# EasyEDA schematic SCH_pcie_2022-12-23.json
TITLE: Sheet_1; REV: 1.0; Date: 2022-12-23; Sheet: 1/1; Company: Your Company
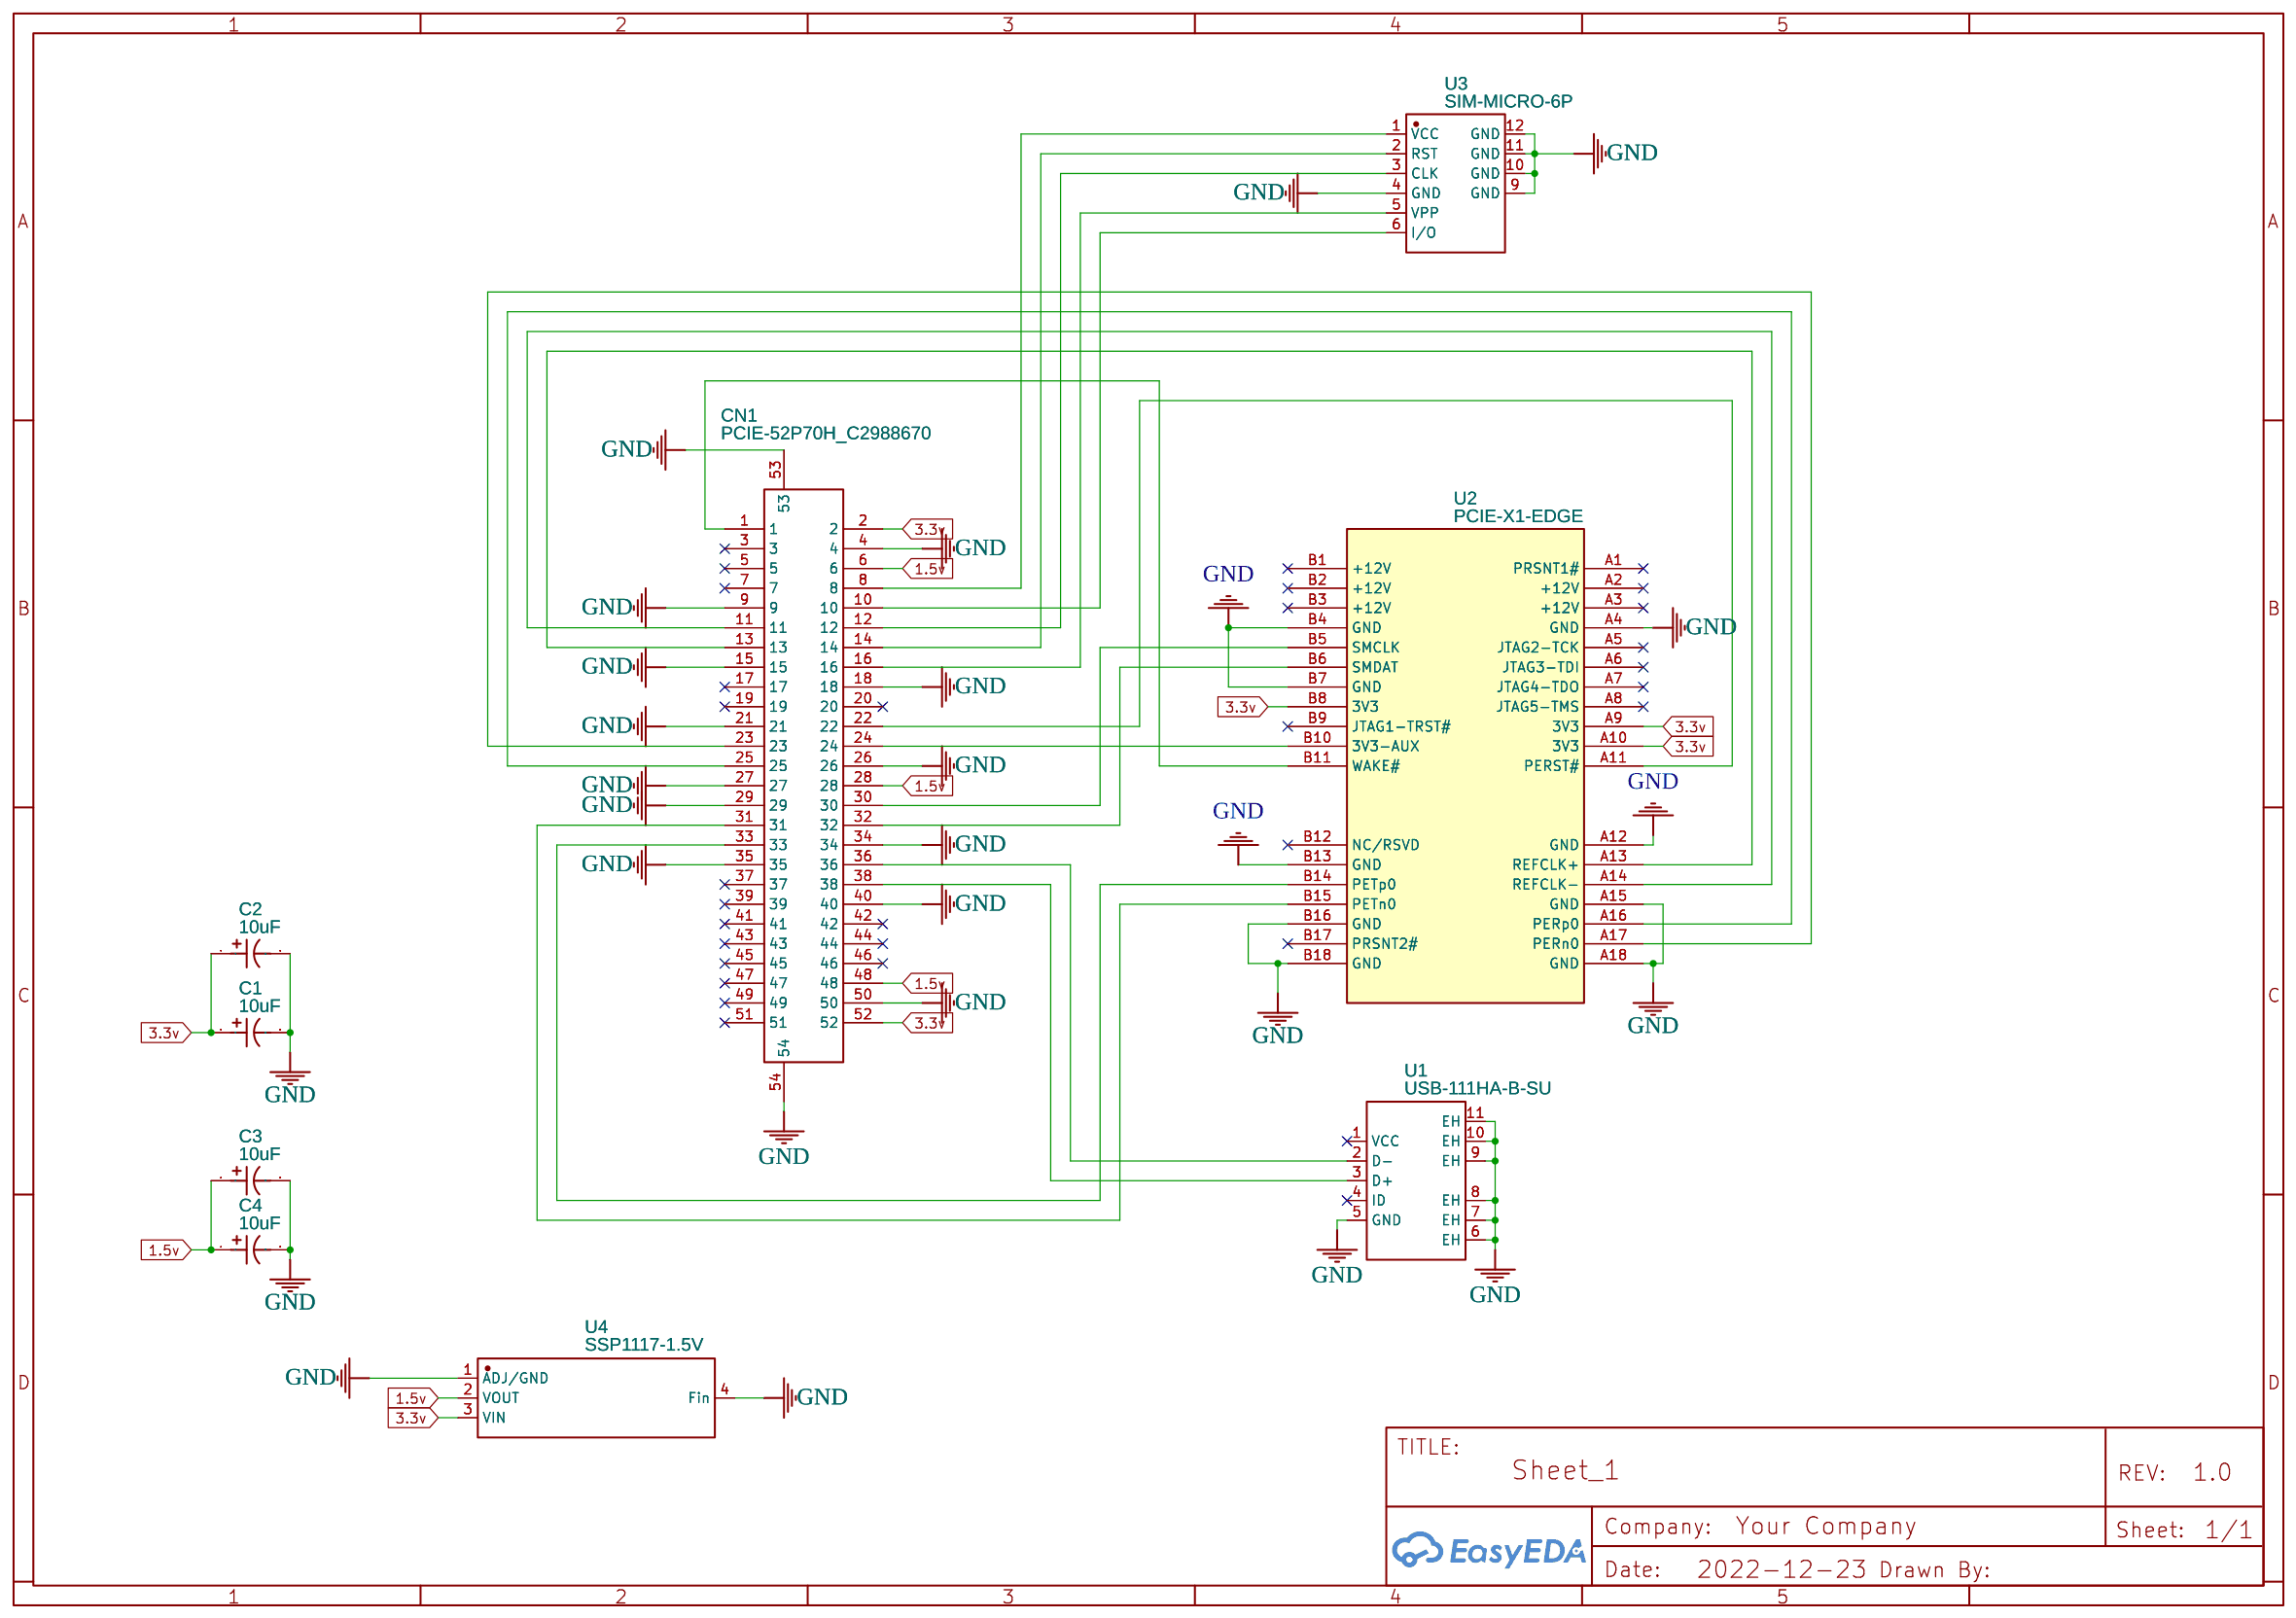
[diagram p0: schematic sheet]

## Parts
C1  10uF  [CAP-SMD_BD4.0-L4.3-W4.3-FD-LS4.8]
C2  10uF  [CAP-SMD_BD4.0-L4.3-W4.3-FD-LS4.8]
C3  10uF  [CAP-SMD_BD4.0-L4.3-W4.3-FD-LS4.8]
C4  10uF  [CAP-SMD_BD4.0-L4.3-W4.3-FD-LS4.8]
CN1  PCIE-52P70H_C2988670  [PCIE-SMD_52P-P0.80_PCIE-52PXXH]
U1  USB-111HA-B-SU  [MICRO-USB-SMD_USB-111HA-B-SU]
U2  PCIE-X1-EDGE  [PCIE-X1-MALE]
U3  SIM-MICRO-6P  [MICRO-SIM-SMD_KH-SIM1616-6PIN]
U4  SSP1117-1.5V  [SOT-223_L6.3-W3.5-P2.30-LS7.0-BR]

## Library data of the parts
C1-C4 = XT10UF35V90RV0070: Supplier: LCSC; Supplier Part: C2992602; Manufacturer: KNSCHA(科尼盛); Contributor: lcsc; JLCPCB Part Class: Extended Part
CN1 = PCIE-52P70H_C2988670: Supplier: LCSC; Supplier Part: C2988670; Manufacturer: SOFNG(硕方); Manufacturer Part: PCIE-52P70H; link: https://atta.szlcsc.comnull; Contributor: LCSC; JLCPCB Part Class: Extended Part
U1 = USB-111HA-B-SU: Supplier: LCSC; Supplier Part: C2939565; Manufacturer: HOOYA(皓宇电子); link: https://atta.szlcsc.com/upload/public/pdf/source/20220124/242EE7715A4A3C37825CBDA142240E59.pdf; JLCPCB Part Class: Extended Part; Contributor: lcsc
U2 = PCIE-X1-EDGE: Contributor: dcs515
U3 = SIM-MICRO-6P: Supplier: LCSC; Supplier Part: C9900009166; Manufacturer: null; Contributor: LCSC; JLCPCB Part Class: Extended Part
U4 = SSP1117-1.5V: Supplier: LCSC; Supplier Part: C308941; Manufacturer: Shanghai Siproin Microelectronics; Contributor: LCSC; JLCPCB Part Class: Extended Part

## Nets
1.5v: C3.1 C4.1 CN1.6 CN1.28 CN1.48 U4.2(VOUT)
3.3v: C1.1 C2.1 CN1.2 CN1.52 U2.A9(3V3) U2.A10(3V3) U2.B8(3V3) U4.3(VIN)
GND: C1.2 C2.2 C3.2 C4.2 CN1.4 CN1.9 CN1.15 CN1.18 CN1.21 CN1.26 CN1.27 CN1.29 CN1.34 CN1.35 CN1.40 CN1.50 CN1.53 CN1.54 U1.5(GND) U1.6(EH) U1.7(EH) U1.8(EH) U1.9(EH) U1.10(EH) U1.11(EH) U2.A4(GND) U2.A12(GND) U2.A15(GND) U2.A18(GND) U2.B4(GND) U2.B7(GND) U2.B13(GND) U2.B16(GND) U2.B18(GND) U3.4(GND) U3.9(GND) U3.10(GND) U3.11(GND) U3.12(GND) U4.1(ADJ/GND) U4.4(Fin)
Net-(CN1-1): CN1.1 U2.B11(WAKE#)
Net-(CN1-8): CN1.8 U3.1(VCC)
Net-(CN1-10): CN1.10 U3.6(I/O)
Net-(CN1-11): CN1.11 U2.A14(REFCLK-)
Net-(CN1-12): CN1.12 U3.3(CLK)
Net-(CN1-13): CN1.13 U2.A13(REFCLK+)
Net-(CN1-14): CN1.14 U3.2(RST)
Net-(CN1-16): CN1.16 U3.5(VPP)
Net-(CN1-22): CN1.22 U2.A11(PERST#)
Net-(CN1-23): CN1.23 U2.A17(PERn0)
Net-(CN1-24): CN1.24 U2.B10(3V3-AUX)
Net-(CN1-25): CN1.25 U2.A16(PERp0)
Net-(CN1-30): CN1.30 U2.B5(SMCLK)
Net-(CN1-31): CN1.31 U2.B15(PETn0)
Net-(CN1-32): CN1.32 U2.B6(SMDAT)
Net-(CN1-33): CN1.33 U2.B14(PETp0)
Net-(CN1-36): CN1.36 U1.2(D-)
Net-(CN1-38): CN1.38 U1.3(D+)

Not connected (* = marked no-connect by the designer): CN1 3* 5* 7* 17* 19* 20* 37* 39* 41* 42* 43* 44* 45* 46* 47* 49* 51*; U1 1(VCC)* 4(ID)*; U2 A1(PRSNT1#)* A2(+12V)* A3(+12V)* A5(JTAG2-TCK)* A6(JTAG3-TDI)* A7(JTAG4-TDO)* A8(JTAG5-TMS)* B1(+12V)* B2(+12V)* B3(+12V)* B9(JTAG1-TRST#)* B12(NC/RSVD)* B17(PRSNT2#)*
